# Altium project Frontend_HB_LEMO.PrjPcb
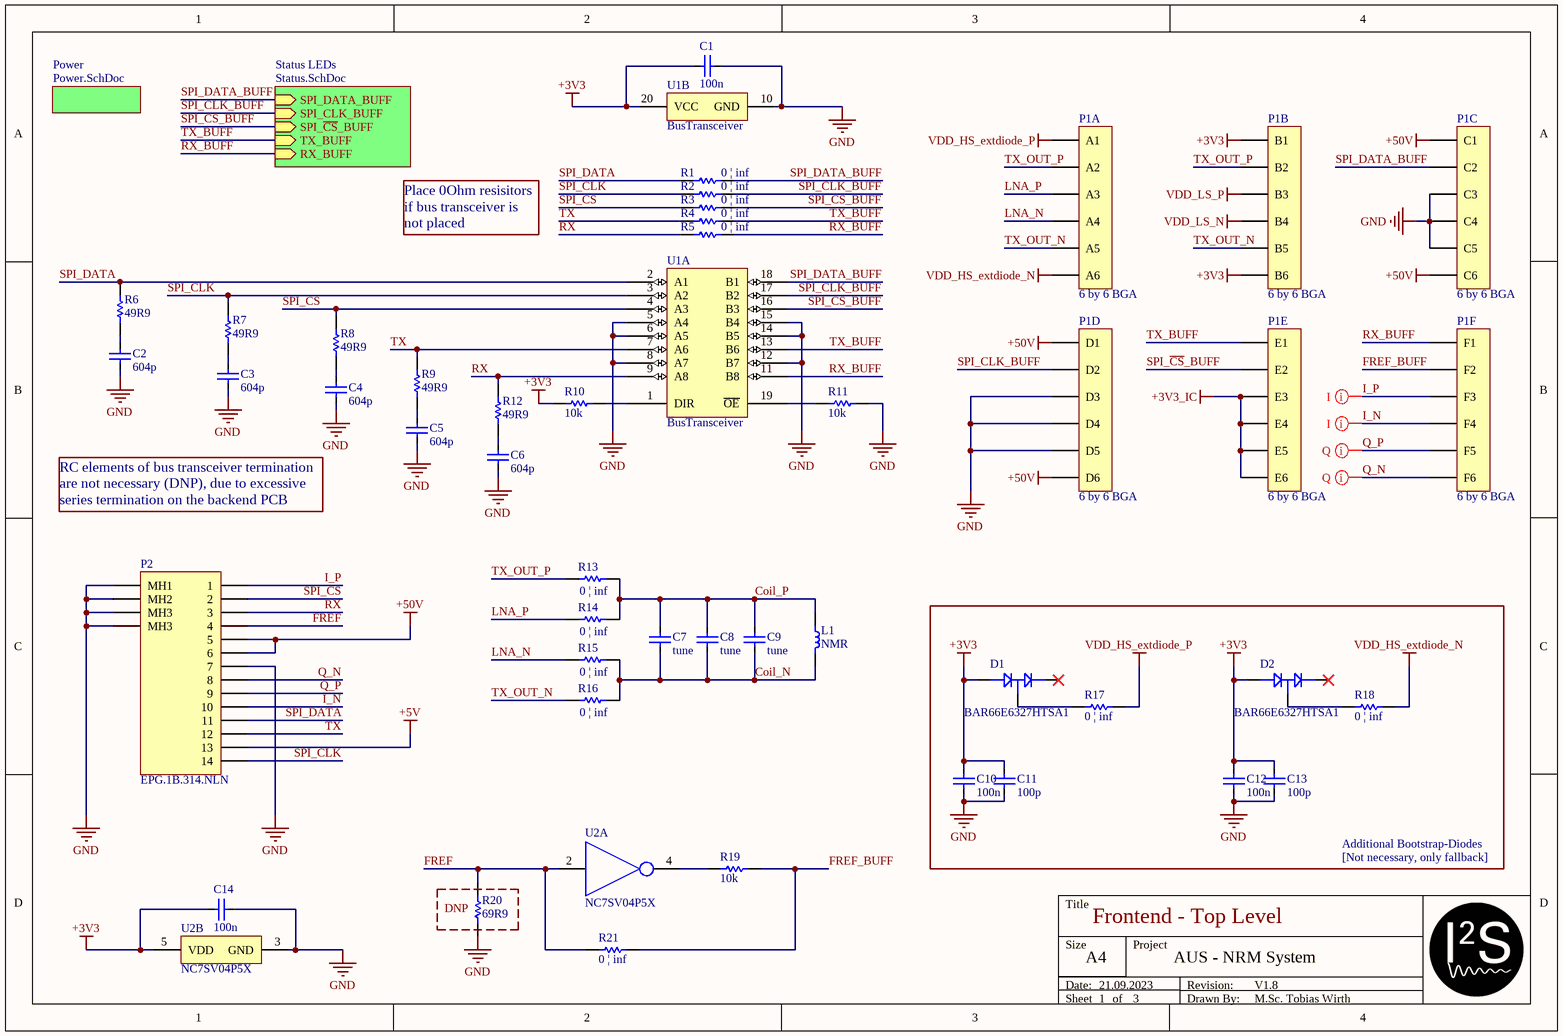
[diagram p0: Frontend.SchDoc]
CAGE_CODE: ?????; CONTRACT_NUMBER: <CONTRACT NO>; DOC_NO_ASSY_DWG: <ASSY DWG NO>; DOC_NO_BOM: <BOM DOC NO>; DOC_NO_FAB_DWG: <FAB DWG NO>; DOC_NO_SCH_DWG: <SCH DWG NO>; PCB_2_DEC_TOL: +/-.01; PCB_3_DEC_TOL: +/-.010; PCB_ANG_TOL: +/-1/2; PCB_ASSEMBLY_NO: <PCB ASSY NO>; PCB_CHECKER: - -----; PCB_CHECKER_APP_DATE: --/--/----; PCB_DESIGNER: - -----; PCB_DESIGNER_APP_DATE: --/--/----; PCB_DWG_NO: <PCB DWG NO>; PCB_ENGINEER: - -----; PCB_ENGINEER_APP_DATE: --/--/----; PCB_PART_NUMBER: <PCB PN>; PCB_REV: A; SCH_REV: A
3 sheets, 84 parts. Net scope: hierarchical (ports join the sheet entries above them; power ports are global).
Board file: Frontend.PcbDoc
Sheets:
  Frontend.SchDoc
    Power = Power.SchDoc
    Status LEDs = Status.SchDoc

## Sheet Frontend.SchDoc: Frontend - Top Level
size A4; Date: 21.09.2023; ApprovedBy: Prof. Dr. Jens Anders; Author: M.Sc. Tobias Wirth; CompanyName: IIS; DrawnBy: M.Sc. Tobias Wirth; Engineer: M.Sc. Tobias Wirth; Organization: University of Stuttgart; Address1: Pfaffenwaldring 47; Address2: 70569 Stuttgart; Revision: V1.8; SheetNumber: 1; SheetTotal: 3; Project: Austrailia - NMR System; ENG_APP_DATE: --/--/--; DSN_APP_DATE: --/--/--; CHK_APP_DATE: --/--/--; ProjectNameAlt: AUS - NRM System; Time: 15:00

### Parts
C1  100n  [CAP_0402]
C2  604p  [CAP_0402]
C3  604p  [CAP_0402]
C4  604p  [CAP_0402]
C5  604p  [CAP_0402]
C6  604p  [CAP_0402]
C7  tune  [CAP_1206]
C8  tune  [CAP_0805]
C9  tune  [CAP_0603]
C10  100n  [CAP_0402]
C11  100p  [CAP_0402]
C12  100n  [CAP_0402]
C13  100p  [CAP_0402]
C14  100n  [CAP_0402]
D1  BAR66E6327HTSA1  [SOT23]
D2  BAR66E6327HTSA1  [SOT23]
L1  NMR  [NMR-Coil-Pads]
P1  6 by 6 BGA  [BGA36C230P6X6_1500X1500X190 - Interposer]  (parts A,B,C,D,E,F of 6)
P2  EPG.1B.314.NLN  [EPG.1B.314.NLN]
R1  0 | inf  [RES_0402]
R2  0 | inf  [RES_0402]
R3  0 | inf  [RES_0402]
R4  0 | inf  [RES_0402]
R5  0 | inf  [RES_0402]
R6  49R9  [RES_0402]
R7  49R9  [RES_0402]
R8  49R9  [RES_0402]
R9  49R9  [RES_0402]
R10  10k  [RES_0402]
R11  10k  [RES_0402]
R12  49R9  [RES_0402]
R13  0 | inf  [RES_0402]
R14  0 | inf  [RES_0402]
R15  0 | inf  [RES_0402]
R16  0 | inf  [RES_0402]
R17  value 0 | inf  [RES_0402]
R18  value 0 | inf  [RES_0402]
R19  10k  [RES_0402]
R20  69R9  [RES_0603]
R21  value 0 | inf  [RES_0402]
U1  BusTransceiver  [TSSOP-20]  (parts A,B of 2)
U2  NC7SV04P5X  [SOT23-65P210X110-5N]  (parts A,B of 2)

### Blocks framed on the sheet
DNP: R20

### Sub-sheets
Power = Power.SchDoc: no entries
Status LEDs = Status.SchDoc: SPI_DATA_BUFF (in), SPI_CLK_BUFF (in), SPI_~{CS}_BUFF (in), TX_BUFF (in), RX_BUFF (in)

### Nets
+3V3: C1.1 C10.1 C11.1 C12.1 C13.1 C14.1 D1.1 D2.1 P1.B1 P1.B6 R10.1 U1.20(VCC) U2.5(VDD)
+3V3_IC: P1.E3 P1.E4 P1.E5 P1.E6
+5V: P2.13
+50V: P1.C1 P1.C6 P1.D1 P1.D6 P2.5 P2.6
GND: C1.2 C2.2 C3.2 C4.2 C5.2 C6.2 C10.2 C11.2 C12.2 C13.2 C14.2 P1.C3 P1.C4 P1.C5 P1.D3 P1.D4 P1.D5 P2.7 P2.15(MH1) P2.16(MH2) P2.17(MH3) P2.18(MH3) R11.2 R20.1 U1.5(A4) U1.6(A5) U1.8(A7) U1.10(GND) U1.12(B7) U1.14(B5) U1.15(B4) U2.3(GND)
VDD_HS_extdiode_N: P1.A6 R18.1
VDD_HS_extdiode_P: P1.A1 R17.1
VDD_LS_N: P1.B4
VDD_LS_P: P1.B3
Coil_N: C7.2 C8.2 C9.2 L1.2 R15.1 R16.1
Coil_P: C7.1 C8.1 C9.1 L1.1 R13.1 R14.1
FREF: P2.4 R20.2 R21.2 U2.2
FREF_BUFF: P1.F2 R19.2 R21.1
I_N: P1.F4 P2.10
I_P: P1.F3 P2.1
LNA_N: P1.A4 R15.2
LNA_P: P1.A3 R14.2
Q_N: P1.F6 P2.8
Q_P: P1.F5 P2.9
RX: P2.3 R5.1 R12.2 U1.9(A8)
RX_BUFF: P1.F1 R5.2 U1.11(B8) ; sheet Status LEDs/RX_BUFF
SPI_~{CS}: P2.2 R3.1 R8.2 U1.4(A3)
SPI_~{CS}_BUFF: P1.E2 R3.2 U1.16(B3) ; sheet Status LEDs/SPI_~{CS}_BUFF
SPI_CLK: P2.14 R2.1 R7.2 U1.3(A2)
SPI_CLK_BUFF: P1.D2 R2.2 U1.17(B2) ; sheet Status LEDs/SPI_CLK_BUFF
SPI_DATA: P2.11 R1.1 R6.2 U1.2(A1)
SPI_DATA_BUFF: P1.C2 R1.2 U1.18(B1) ; sheet Status LEDs/SPI_DATA_BUFF
TX: P2.12 R4.1 R9.2 U1.7(A6)
TX_BUFF: P1.E1 R4.2 U1.13(B6) ; sheet Status LEDs/TX_BUFF
TX_OUT_N: P1.A5 P1.B5 R16.2
TX_OUT_P: P1.A2 P1.B2 R13.2
NetC2_1: C2.1 R6.1
NetC3_1: C3.1 R7.1
NetC4_1: C4.1 R8.1
NetC5_1: C5.1 R9.1
NetC6_1: C6.1 R12.1
NetD1_3: D1.3 R17.2
NetD2_3: D2.3 R18.2
NetR10_2: R10.2 U1.1(DIR)
NetR11_1: R11.1 U1.19(~{OE})
NetR19_1: R19.1 U2.4

Not connected (* = marked no-connect by the designer): D1 2*; D2 2*

### Layout directives
differential pair; differential pair class IQ; net class IQ: I_N, I_P, Q_N, Q_P

### Notes on the sheet
- Place 0Ohm resisitors if bus transceiver is not placed
- RC elements of bus transceiver termination are not necessary (DNP), due to excessive series termination on the backend PCB
- Additional Bootstrap-Diodes
  [Not necessary, only fallback]
- Title
- Size
- Date:
- Sheet
- A4
- of
- Project
- Drawn By:
- Revision:

### Library data of the parts
C1-C14 = Cap: Supplier: *; Part Number: *
  C1 C10 C12 C14: Value: 100n
  C2-C6: Value: 604p
  C7-C9: Value: tune
  C11 C13: Value: 100p
D1 D2 = Diode_series: SMP1320-075LF (SC-70) / BAV99 (SOT23)
L1 = Ind: Part Number: *; Supplier: *; Value: NMR
P1 = BGA_6x6
P2 = EPG.1B.314.NLN: LEMO Connector - 14 pin EPG.1B.314.NLN Elbow receptacle for printed circuit (solder mount), Female Contact Drawing Rev. 00 Source: http://www.lemo.com/catalog/ROW/UK_English/unipole_multipole.pdf
R1-R21 = Res: Part Number: *; Supplier: *
  R1-R5 R13-R16: Value: 0 | inf
  R6-R9 R12: Value: 49R9
  R10 R11 R19: Value: 10k
  R20: Value: 69R9
U1 = 74LVC245A

## Sheet Power.SchDoc: PDN (LDO / CCs / ESD)
size A4; Date: 21.09.2023; ApprovedBy: Prof. Dr. Jens Anders; CheckedBy: M.Sc. Tobias Wirth; Author: M.Sc. Tobias Wirth; CompanyName: IIS; DrawnBy: M.Sc. Tobias Wirth; Engineer: M.Sc. Tobias Wirth; Organization: University of Stuttgart; Address1: Pfaffenwaldring 47; Address2: 70569 Stuttgart; Revision: V1.2; SheetNumber: 2; SheetTotal: 3; ProjectNameAlt: AUS - NMR System; Time: 15:03; ImagePath: N/A; Application_BuildNumber: N/A
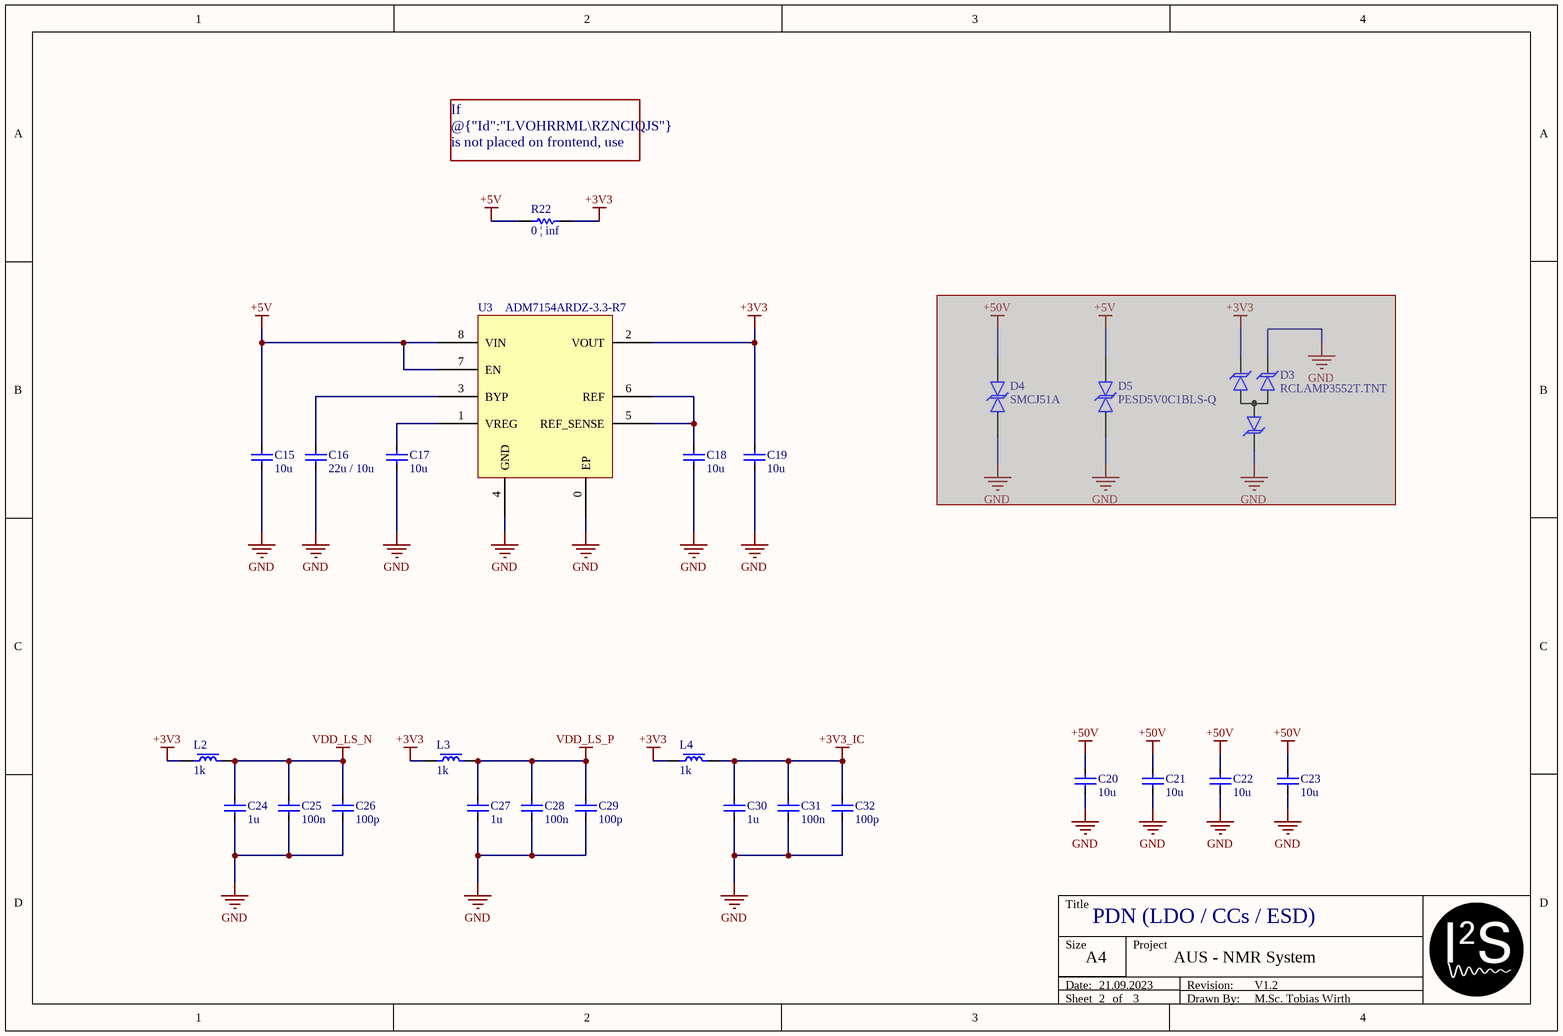
[diagram p1: Power.SchDoc]

### Parts
C15  10u  [CAP_0603]
C16  22u / 10u  [CAP_0603]
C17  10u  [CAP_0603]
C18  10u  [CAP_0603]
C19  10u  [CAP_0603]
C20  10u  [CAP_0805]
C21  10u  [CAP_0805]
C22  10u  [CAP_0805]
C23  10u  [CAP_0805]
C24  1u  [CAP_0402]
C25  100n  [CAP_0402]
C26  100p  [CAP_0402]
C27  1u  [CAP_0402]
C28  100n  [CAP_0402]
C29  100p  [CAP_0402]
C30  1u  [CAP_0402]
C31  100n  [CAP_0402]
C32  100p  [CAP_0402]
D3  RCLAMP3552T.TNT  [DFN45P60X43-3L]  (masked out: inside a compile mask, not in the netlist)
D4  SMCJ51A  [SON680P690X262-2N]  (masked out: inside a compile mask, not in the netlist)
D5  PESD5V0C1BLS-Q  [RES_0402]  (masked out: inside a compile mask, not in the netlist)
L2  1k  [CAP_0402]
L3  1k  [CAP_0402]
L4  1k  [CAP_0402]
R22  0 | inf  [RES_0402]
U3  ADM7154ARDZ-3.3-R7  [SOIC-8_TP]

### Nets
+3V3: C19.1 L2.1 L3.1 L4.1 R22.2 U3.2(VOUT)
+3V3_IC: C30.1 C31.1 C32.1 L4.2
+5V: C15.1 R22.1 U3.7(EN) U3.8(VIN)
+50V: C20.1 C21.1 C22.1 C23.1
GND: C15.2 C16.2 C17.2 C18.2 C19.2 C20.2 C21.2 C22.2 C23.2 C24.2 C25.2 C26.2 C27.2 C28.2 C29.2 C30.2 C31.2 C32.2 U3.0(EP) U3.4(GND)
VDD_LS_N: C24.1 C25.1 C26.1 L2.2
VDD_LS_P: C27.1 C28.1 C29.1 L3.2
NetC16_1: C16.1 U3.3(BYP)
NetC17_1: C17.1 U3.1(VREG)
NetC18_1: C18.1 U3.5(REF_SENSE) U3.6(REF)

### Notes on the sheet
- If @{"Id":"LVOHRRML\RZNCIQJS"} is not placed on frontend, use @{"Id":"LVOHRRML\GEZNSQGU"} to bridge the +5V and +3V3 nets
- Title
- Size
- Date:
- Sheet
- A4
- of
- Project
- Drawn By:
- Revision:

### Library data of the parts
C15-C32 = Cap: Supplier: *; Part Number: *
  C15 C17-C23: Value: 10u
  C16: Value: 22u / 10u
  C24 C27 C30: Value: 1u
  C25 C28 C31: Value: 100n
  C26 C29 C32: Value: 100p
D3 = TSV Diode 2 Channel
D4 D5 = TSV Diode Bidirectional
L2-L4 = FerriteBead: Part Number: *; Supplier: *; Value: 1k
R22 = Res: Part Number: *; Supplier: *; Value: 0 | inf
U3 = ADM715X

## Sheet Status.SchDoc: Status LEDs
size A4; Date: 04.10.2023; ApprovedBy: M.Sc. Tobias Wirth; CheckedBy: M.Sc. Tobias Wirth; Author: M.Sc. Tobias Wirth; CompanyName: University of Stuttgart; DrawnBy: M.Sc. Tobias Wirth; Engineer: M.Sc. Tobias Wirth; Organization: IIS; Address1: Pfaffenwaldring 47; Address2: 70569 Stuttgart; Revision: V1.2; SheetNumber: 3; SheetTotal: 3; ProjectNameAlt: AUS - NMR System; Time: 19:30; ImagePath: N/A; Application_BuildNumber: N/A
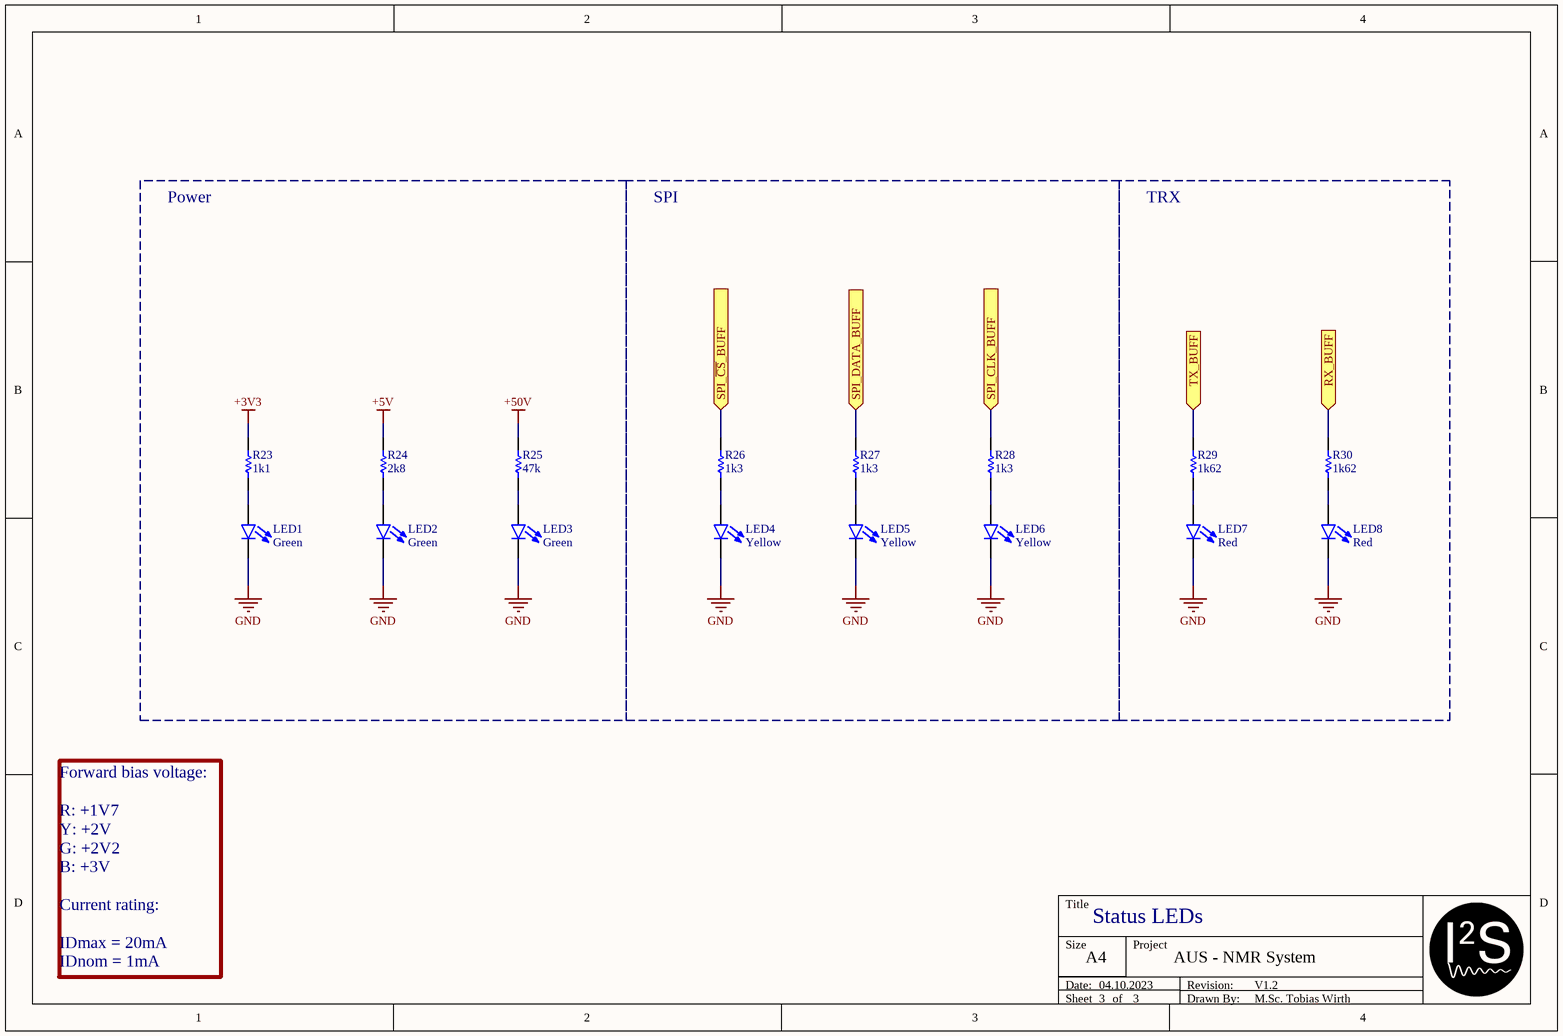
[diagram p2: Status.SchDoc]

### Parts
LED1  Green  [RES_0603]
LED2  Green  [RES_0603]
LED3  Green  [RES_0603]
LED4  Yellow  [RES_0603]
LED5  Yellow  [RES_0603]
LED6  Yellow  [RES_0603]
LED7  Red  [RES_0603]
LED8  Red  [RES_0603]
R23  1k1  [RES_0402]
R24  2k8  [RES_0402]
R25  47k  [RES_0402]
R26  1k3  [RES_0402]
R27  1k3  [RES_0402]
R28  1k3  [RES_0402]
R29  1k62  [RES_0402]
R30  1k62  [RES_0402]

### Blocks framed on the sheet
Power: LED1-LED3 R23-R25
SPI: LED4-LED6 R26-R28
TRX: LED7 LED8 R29 R30

### Ports
RX_BUFF (in), SPI_CLK_BUFF (in), SPI_DATA_BUFF (in), SPI_~{CS}_BUFF (in), TX_BUFF (in)

### Nets
+3V3: R23.2
+5V: R24.2
+50V: R25.2
GND: LED1.2 LED2.2 LED3.2 LED4.2 LED5.2 LED6.2 LED7.2 LED8.2
RX_BUFF: R30.2 ; port RX_BUFF
SPI_~{CS}_BUFF: R26.2 ; port SPI_~{CS}_BUFF
SPI_CLK_BUFF: R28.2 ; port SPI_CLK_BUFF
SPI_DATA_BUFF: R27.2 ; port SPI_DATA_BUFF
TX_BUFF: R29.2 ; port TX_BUFF
NetLED1_1: LED1.1 R23.1
NetLED2_1: LED2.1 R24.1
NetLED3_1: LED3.1 R25.1
NetLED4_1: LED4.1 R26.1
NetLED5_1: LED5.1 R27.1
NetLED6_1: LED6.1 R28.1
NetLED7_1: LED7.1 R29.1
NetLED8_1: LED8.1 R30.1

### Notes on the sheet
- Forward bias voltage:
  R: +1V7
  Y: +2V
  G: +2V2
  B: +3V
  Current rating:
  IDmax = 20mA
  IDnom = 1mA
- Title
- Size
- Date:
- Sheet
- A4
- of
- Project
- Drawn By:
- Revision:

### Library data of the parts
LED1-LED8 = LED
R23-R30 = Res: Part Number: *; Supplier: *
  R23: Value: 1k1
  R24: Value: 2k8
  R25: Value: 47k
  R26-R28: Value: 1k3
  R29 R30: Value: 1k62

## Nets that join several sheets
+3V3: Frontend (13 pins), Power (6 pins), Status (R23.2)
+3V3_IC: Frontend (P1.E3 P1.E4 P1.E5 P1.E6), Power (C30.1 C31.1 C32.1 L4.2)
+5V: Frontend (P2.13), Power (C15.1 R22.1 U3.7 U3.8), Status (R24.2)
+50V: Frontend (6 pins), Power (C20.1 C21.1 C22.1 C23.1), Status (R25.2)
GND: Frontend (32 pins), Power (20 pins), Status (8 pins)
VDD_LS_N: Frontend (P1.B4), Power (C24.1 C25.1 C26.1 L2.2)
VDD_LS_P: Frontend (P1.B3), Power (C27.1 C28.1 C29.1 L3.2)
RX_BUFF: Frontend (P1.F1 R5.2 U1.11), Status (R30.2)
SPI_~{CS}_BUFF: Frontend (P1.E2 R3.2 U1.16), Status (R26.2)
SPI_CLK_BUFF: Frontend (P1.D2 R2.2 U1.17), Status (R28.2)
SPI_DATA_BUFF: Frontend (P1.C2 R1.2 U1.18), Status (R27.2)
TX_BUFF: Frontend (P1.E1 R4.2 U1.13), Status (R29.2)